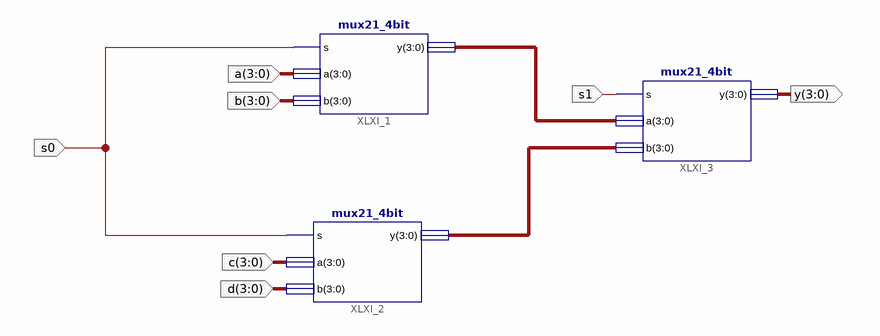
[diagram p0: schematic sheet 1]
// Xilinx ISE schematic mux41_4bit1.sch (spartan3e) as structural Verilog: 3 symbols, 7 ports
module mux41_4bit1 (
  input  s1,
  input  [3:0] a,
  input  [3:0] b,
  input  [3:0] c,
  input  [3:0] d,
  input  s0,
  output [3:0] y
);

  wire [3:0] XLXN_1, XLXN_2;

  mux21_4bit XLXI_1 (.s(s0), .a(a), .b(b), .y(XLXN_1));
  mux21_4bit XLXI_2 (.s(s0), .a(c), .b(d), .y(XLXN_2));
  mux21_4bit XLXI_3 (.s(s1), .a(XLXN_1), .b(XLXN_2), .y(y));
endmodule
